# Altium schematic sheet Accel.SchDoc
size A
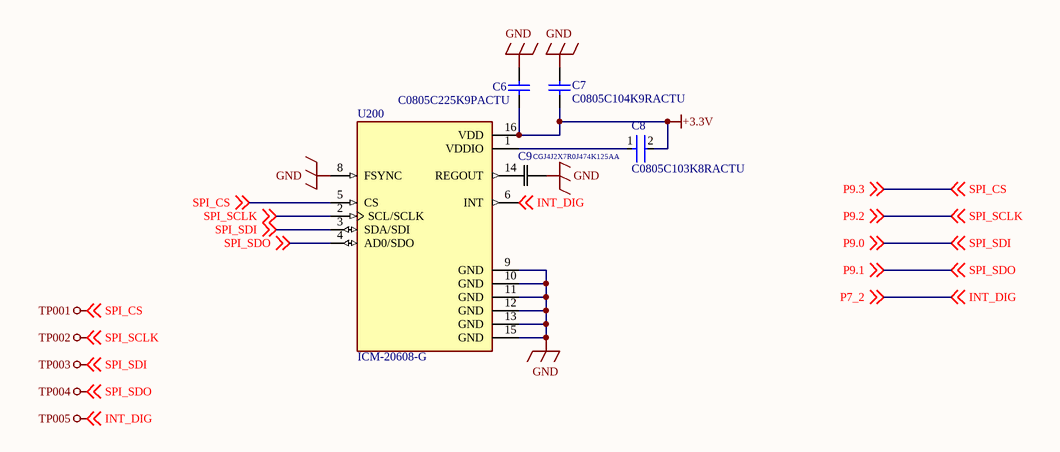
[diagram p0: Accel.SchDoc]

## Parts
C6  C0805C225K9PACTU  [CAPC2013X145X50ML20T25]
C7  C0805C104K9RACTU  [CAPC2013X145X50LL20T25]
C8  C0805C103K8RACTU  [FP-C0805C-DN-MFG]
C9  CGJ4J2X7R0J474K125AA  [CAP_2012_TDK]
U200  ICM-20608-G  [PQFN50P300X300X80-16N]

## Nets
+3.3V: C6.1 C7.1 C8.2 U200.16(VDD)
GND: C6.2 C7.2 C9.2 U200.8(FSYNC) U200.9(GND) U200.10(GND) U200.11(GND) U200.12(GND) U200.13(GND) U200.15(GND)
TP001: U200.5(CS) ; off-sheet SPI_CS, off-sheet P9.3  [also labelled P9.3, SPI_CS]
TP002: U200.2(SCL/SCLK) ; off-sheet SPI_SCLK, off-sheet P9.2  [also labelled P9.2, SPI_SCLK]
TP003: U200.3(SDA/SDI) ; off-sheet SPI_SDI, off-sheet P9.0  [also labelled P9.0, SPI_SDI]
TP004: U200.4(AD0/SDO) ; off-sheet SPI_SDO, off-sheet P9.1  [also labelled P9.1, SPI_SDO]
TP005: U200.6(INT) ; off-sheet INT_DIG, off-sheet P7_2  [also labelled INT_DIG, P7_2]
NetC8_1: C8.1 U200.1(VDDIO)

Not connected (* = marked no-connect by the designer): C9 1; U200 14(REGOUT)

## Library data of the parts
C6 = CMP-1036-04819-2: Manufacturer: Kemet; Part Number: C0805C225K9PACTU
C7 = CMP-1036-04391-2: Manufacturer: Kemet; Part Number: C0805C104K9RACTU
C8 = CMP-1036-03808-3: CAP CER 10000PF 10V X7R 0805; Manufacturer: KEMET; Material: Ceramic; Value: 10,000 pF; Temperature Coefficient: 30ppm/°C; Tolerance: 0.1; RoHS: TRUE; Lead Free: Yes; Temperature: -55°C to +125°C; Device Class L2: Capacitors; Temperature Characteristic: X7R; Device Class L1: Passive Components; Mouser Description: Multilayer Ceramic Capacitors MLCC - SMD/SMT 10volts 10000pF X7R 10%; Category: Cap; Ipc Land Pattern Name: CAPC200125X78; Height: 0.88mm; ComponentLink2URL: https://content.kemet.com/datasheets/KEM_C1003_C0G_SMD.pdf; Capacitance: 10,000 pF; Temperature Range High: +125°C; Manufacturer Part Number: C0805C103K8RACTU; Automotive: No; ComponentLink2Description: Datasheet; Octopart: https://octopart.com/c0805c103k8ractu-kemet-12595572; Device Class L3: Ceramic Capacitors; Temperature Range Low: -55°C; Package: C0805C-DN; Voltage Rating: 10 V; Digikey Description: CAP CER 10000PF 10V X7R 0805
C9 = CGJ4J2X7R0J474K125AA: No Description Available; Mfr_Name: TDK
U200 = ICM-20608-G: Accelerometer, Gyroscope, 6 Axis Sensor IÂ²C, SPI Output; MF: TDK InvenSense; Package: LGA-16 InvenSense; Purchase-URL: https://pricing.snapeda.com/search/part/ICM-20608-G/?ref=eda; Value: *; Price: None; Availability: Good; MP: ICM-20608-G; SnapEDA_Link: https://www.snapeda.com/parts/ICM-20608-G/TDK%20InvenSense/view-part/196551/?ref=snap